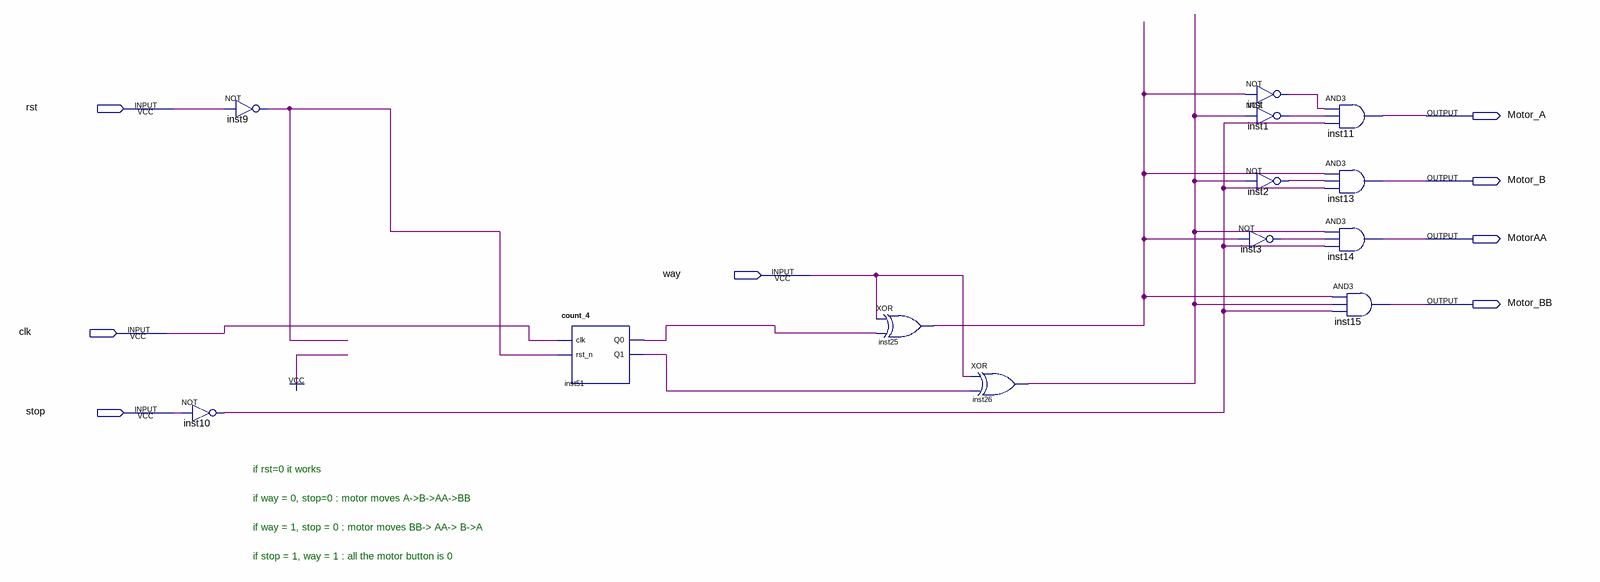
[diagram p0: schematic sheet]
// Quartus schematic motorMove_simul.bdf as structural Verilog: 13 symbols, 8 pins
module motorMove_simul (
  input  rst,
  input  way,
  input  clk,
  input  stop,
  output Motor_A,
  output Motor_B,
  output MotorAA,
  output Motor_BB
);

  wire inst1_out, inst2_out, inst3_out, inst9_out, inst10_out, inst25_out, inst26_out, inst51_q0, inst51_q1,
       inst_out;

  not inst10 (inst10_out, stop);
  not inst9 (inst9_out, rst);
  count_4 inst51 (.clk(clk), .rst_n(inst9_out), .Q0(inst51_q0), .Q1(inst51_q1));
  xor inst25 (inst25_out, way, inst51_q0);
  xor inst26 (inst26_out, way, inst51_q1);
  not inst (inst_out, inst25_out);
  not inst1 (inst1_out, inst26_out);
  not inst2 (inst2_out, inst26_out);
  not inst3 (inst3_out, inst25_out);
  and inst11 (Motor_A, inst_out, inst1_out, inst10_out);
  and inst13 (Motor_B, inst25_out, inst2_out, inst10_out);
  and inst14 (MotorAA, inst26_out, inst3_out, inst10_out);
  and inst15 (Motor_BB, inst25_out, inst26_out, inst10_out);

  // Notes on the sheet:
  //   if rst=0 it works
  //   if way = 0, stop=0 : motor moves A->B->AA->BB
  //   if way = 1, stop = 0 : motor moves BB-> AA-> B->A
  //   if stop = 1, way = 1 : all the motor button is 0
endmodule
